# Altium project SmallHandheldRev1.PrjPCB
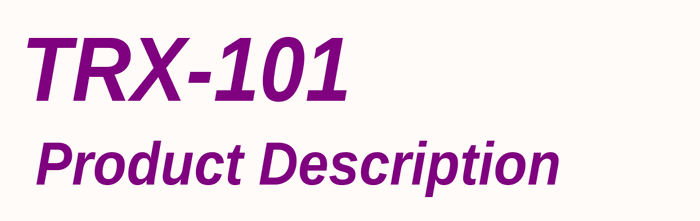
[diagram p0: PG01_Opening Page.SchDoc]
6 sheets, 248 parts. Net scope: global (net labels, ports and power ports of the same name join across sheets).
Board file: SmallHandheldRev1.PcbDoc
Sheets:
  PG01_Opening Page.SchDoc
  PG02_Index and Revs.SchDoc
  PG03_Schematic Sheet1.SchDoc
  PG04_Schematic Sheet2.SchDoc
  PG05_Schematic Sheet3.SchDoc
  PG06_Schematic Sheet4.SchDoc

## Sheet PG01_Opening Page.SchDoc: Opening Page
size B; Date: 12/29/2011; ApprovedBy: Touraj; DrawnBy: Touraj Ghaffari; Engineer: Touraj; Organization: ActiveWave; Address1: 902 Clint Moore Rd., Suite 126; Address2: Boca Raton; Address3: FL, 33487; Address4: 561-999-9422; DocumentNumber: 1; Revision: 1; SheetNumber: 1; SheetTotal: 6; PageSetup: Record=PageOptions|CenterHorizontal=True|CenterVertical=True|PrintScale=0.68|XCorrection=1.00|YCorrection=1.00|PrintKind=0|BorderSize=5000000|LeftOffset=0|BottomOffset=0|Orientation=2|PaperLength=1000|PaperWidth=1000|Scale=100|PaperSource=7|PrintQuality=-4|MediaType=1|DitherType=10|PaperKind=Letter (8.5 x 11 in.)|PrintScaleMode=1; Project: Small Handheld Reader

### Notes on the sheet
- TRX-101
- Product Description
- APPROVALS
- DATE
- Title:
- Drawn:
- Checked:
- Release:
- Date:
- Size:
- Sheet Name:
- B
- Number:
- Time:
- Revision:
- Sheet
- of
- File:

## Sheet PG02_Index and Revs.SchDoc: Index and Revisions
size B; Date: 12/29/2011; ApprovedBy: Touraj; DrawnBy: Touraj Ghaffari; Engineer: Touraj; Organization: ActiveWave; Address1: 902 Clint Moore Rd., Suite 126; Address2: Boca Raton; Address3: FL, 33487; Address4: 561-999-9422; DocumentNumber: 2; Revision: 1; SheetNumber: 2; SheetTotal: 6; PageSetup: Record=PageOptions|CenterHorizontal=True|CenterVertical=True|PrintScale=0.68|XCorrection=1.00|YCorrection=1.00|PrintKind=0|BorderSize=5000000|LeftOffset=0|BottomOffset=0|Orientation=2|PaperLength=1000|PaperWidth=1000|Scale=100|PaperSource=7|PrintQuality=-4|MediaType=1|DitherType=10|PaperKind=Letter|PrintScaleMode=1; Project: Small Hand Held Readere
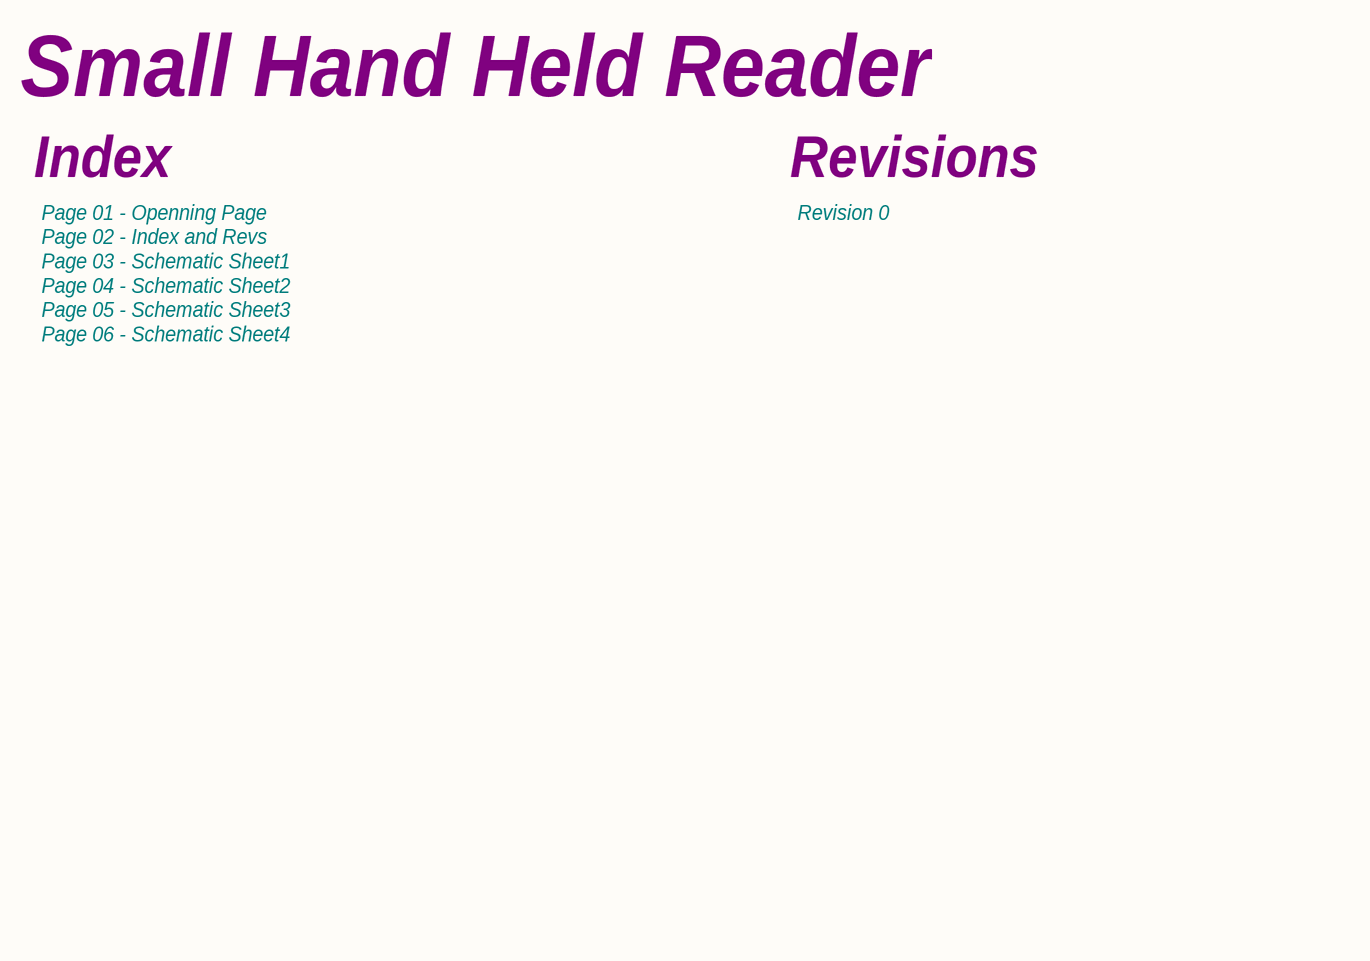
[diagram p1: PG02_Index and Revs.SchDoc]

### Notes on the sheet
- Small Hand Held Reader
- Index
- Revisions
- Page 01 - Openning Page
  Page 02 - Index and Revs
  Page 03 - Schematic Sheet1
  Page 04 - Schematic Sheet2
  Page 05 - Schematic Sheet3
  Page 06 - Schematic Sheet4
- Revision 0
- APPROVALS
- DATE
- Title:
- Drawn:
- Checked:
- Release:
- Date:
- Size:
- Sheet Name:
- B
- Number:
- Time:
- Revision:
- Sheet
- of
- File:

## Sheet PG03_Schematic Sheet1.SchDoc: Sheet 1  Receiver
size B; Date: 12/29/2011; ApprovedBy: Touraj; DrawnBy: Touraj Ghaffari; Engineer: Touraj; Organization: ActiveWave; Address1: 902 Clint Moore Rd., Suite 126; Address2: Boca Raton; Address3: FL, 33487; Address4: 561-999-9422; DocumentNumber: 3; Revision: 1; SheetNumber: 3; SheetTotal: 6; PageSetup: Record=PageOptions|CenterHorizontal=True|CenterVertical=True|PrintScale=0.70|XCorrection=1.00|YCorrection=1.00|PrintKind=0|BorderSize=5000000|LeftOffset=0|BottomOffset=0|Orientation=2|PaperLength=1000|PaperWidth=1000|Scale=100|PaperSource=7|PrintQuality=-4|MediaType=1|DitherType=10|PaperKind=Letter|PrintScaleMode=1; Project: Samll Hand Held Reader
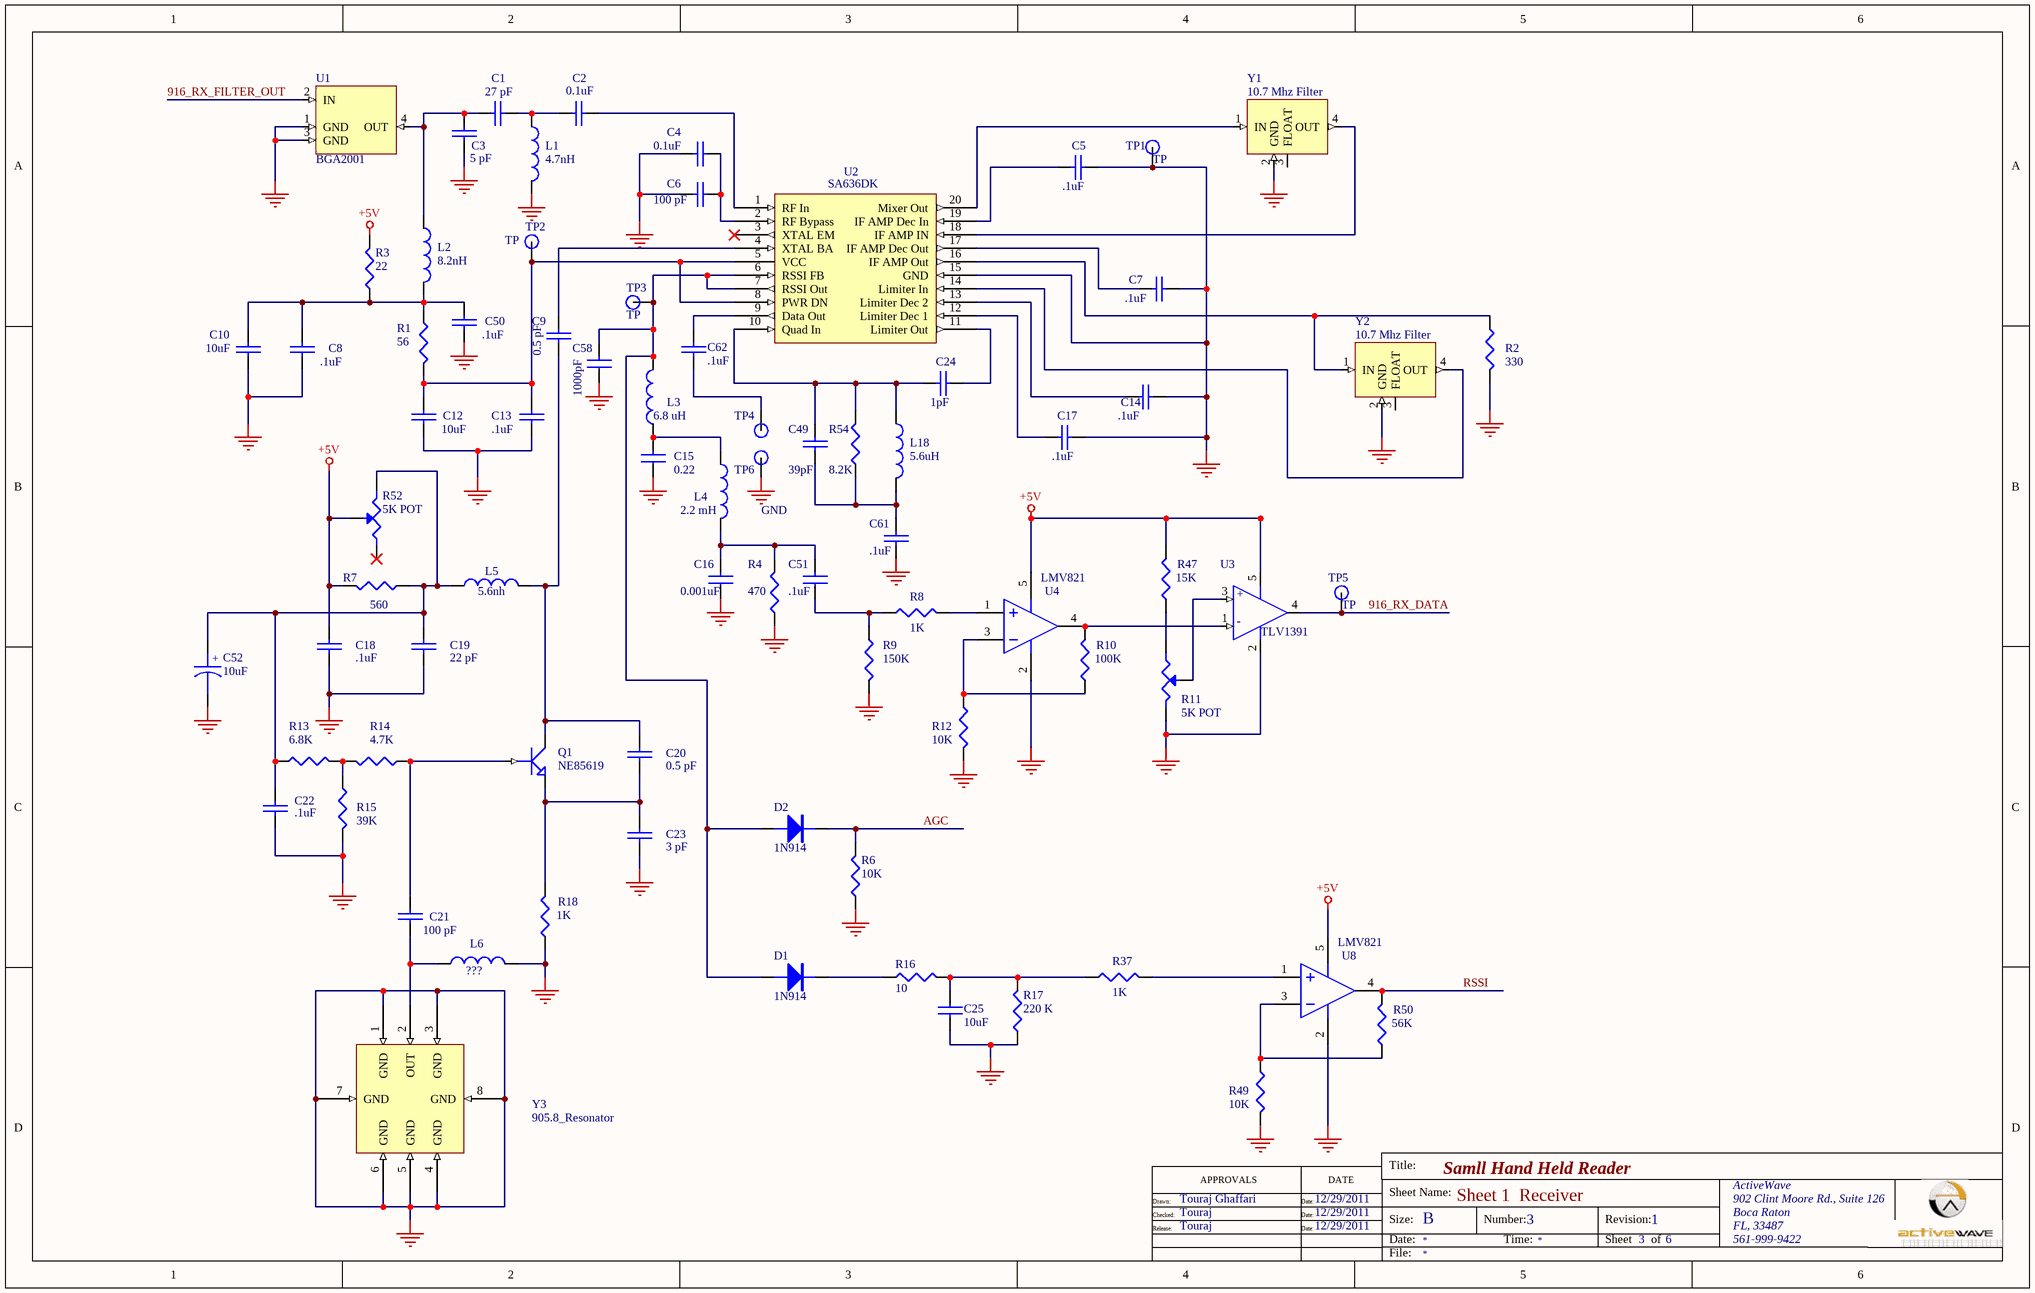
[diagram p2: PG03_Schematic Sheet1.SchDoc]

### Parts
C1  27 pF  [0603]
C2  0.1uF  [0603]
C3  5 pF  [0603]
C4  0.1uF  [0603]
C5  .1uF  [0603]
C6  100 pF  [0603]
C7  .1uF  [0603]
C8  .1uF  [0603]
C9  0.5 pF  [0603]
C10  10uF  [CAP A CASE]
C12  10uF  [CAP A CASE]
C13  .1uF  [0603]
C14  .1uF  [0603]
C15  0.22  [0603]
C16  0.001uF  [0603]
C17  .1uF  [0603]
C18  .1uF  [0603]
C19  22 pF  [0603]
C20  0.5 pF  [0603]
C21  100 pF  [0603]
C22  .1uF  [0603]
C23  3 pF  [0603]
C24  1pF  [0603]
C25  10uF  [CAP A CASE]
C49  39pF  [0603]
C50  .1uF  [0603]
C51  .1uF  [0603]
C52  10uF  [CAP A CASE]
C58  1000pF  [0603]
C61  .1uF  [0603]
C62  .1uF  [0603]
D1  1N914  [SOT23 DIODE]
D2  1N914  [SOT23 DIODE]
L1  4.7nH  [0603]
L2  8.2nH  [0603]
L3  6.8 uH  [0805]
L4  2.2 mH  [COIL TKS5540CT-ND]
L5  5.6nh  [0603]
L6  ???  [0603]
L18  5.6uH  [0603]
Q1  NE85619  [3 PIN ULTRA SUPER MINI MOLD]
R1  56  [0603]
R2  330  [0603]
R3  22  [0603]
R4  470  [0603]
R6  10K  [0603]
R7  560  [0603]
R8  1K  [0603]
R9  150K  [0603]
R10  100K  [0603]
R11  5K POT  [POT PANA EVN5]
R12  10K  [0603]
R13  6.8K  [0603]
R14  4.7K  [0603]
R15  39K  [0603]
R16  10  [0603]
R17  220 K  [0603]
R18  1K  [0603]
R37  1K  [0603]
R47  15K  [0603]
R49  10K  [0603]
R50  56K  [0603]
R52  5K POT  [POT PANA EVN5]
R54  8.2K  [0603]
TP1  TP  [TESTPOINT]
TP2  TP  [TESTPOINT]
TP3  TP  [TESTPOINT]
TP4  TP  [TESTPOINT]  (value not drawn)
TP5  TP  [TESTPOINT]
TP6  GND  [TESTPOINT]
U1  BGA2001  [SOT343]
U2  SA636DK  [SSOP20]
U3  TLV1391  [SOT25]
U4  LMV821  [SOT25]
U8  LMV821  [SOT25]
Y1  10.7 Mhz Filter  [FILTER2]
Y2  10.7 Mhz Filter  [FILTER2]
Y3  905.8_Resonator  [RESONATOR]

### Nets
+5V: C18.1 R3.2 R7.2 R47.2 R52.2 U3.5(VDD) U4.5 U8.5
GND_SIGNAL: C3.2 C4.1 C5.2 C6.1 C7.2 C8.2 C10.2 C12.2 C13.2 C14.2 C15.1 C16.1 C17.2 C18.2 C19.2 C22.2 C23.2 C25.2 C50.2 C52.2 C58.1 C61.2 L1.2 L6.2 R2.2 R4.1 R6.2 R9.2 R11.3 R12.2 R15.2 R17.2 R18.1 R49.2 TP1.1(TP) TP6.1(TP) U1.1(GND) U1.3(GND) U2.15(GND) U3.2(VSS) U4.2 U8.2 Y1.2(GND) Y2.2(GND) Y3.1(GND) Y3.3(GND) Y3.4(GND) Y3.5(GND) Y3.6(GND) Y3.7(GND) Y3.8(GND)
916_RX_DATA: TP5.1(TP) U3.4(OUT)
916_RX_FILTER_OUT: U1.2(IN)
AGC: D2.K R6.1
RSSI: R50.2 U8.4
NetC1_1: C1.1 C3.1 L2.1 U1.4(OUT)
NetC1_2: C1.2 C2.1 L1.1
NetC2_2: C2.2 U2.1(RF_In)
NetC4_2: C4.2 C6.2 U2.2(RF_Bypass)
NetC5_1: C5.1 U2.19(IF_AMP_Dec_In)
NetC7_1: C7.1 U2.17(IF_AMP_Dec_Out)
NetC8_1: C8.1 C10.1 C50.1 L2.2 R1.1 R3.1
NetC9_1: C9.1 C20.1 L5.2 Q1.C
NetC9_2: C9.2 U2.4(XTAL_BA)
NetC12_1: C12.1 C13.1 R1.2 TP2.1(TP) U2.5(VCC) U2.8(PWR_DN)
NetC14_1: C14.1 U2.13(Limiter_Dec_2)
NetC15_2: C15.2 L3.1 L4.1
NetC16_2: C16.2 C51.2 L4.2 R4.2
NetC17_1: C17.1 U2.12(Limiter_Dec_1)
NetC19_1: C19.1 C22.1 C52.1 L5.1 R7.1 R13.1 R52.1
NetC20_2: C20.2 C23.1 Q1.E R18.2
NetC21_1: C21.1 Q1.B R14.1
NetC21_2: C21.2 L6.1 Y3.2(OUT)
NetC24_1: C24.1 C49.1 L18.1 R54.2 U2.10(Quad_In)
NetC24_2: C24.2 U2.11(Limiter_Out)
NetC25_1: C25.1 R16.1 R17.1 R37.1
NetC49_2: C49.2 C61.1 L18.2 R54.1
NetC51_1: C51.1 R8.1 R9.1
NetC58_2: C58.2 D1.A D2.A L3.2 TP3.1(TP) U2.6(RSSI_FB) U2.7(RSSI_Out)
NetC62_1: C62.1 TP4.1(TP)
NetC62_2: C62.2 U2.9(Data_Out)
NetD1_K: D1.K R16.2
NetR2_1: R2.1 U2.16(IF_AMP_Out) Y2.1(IN)
NetR8_2: R8.2 U4.1
NetR10_1: R10.1 R12.1 U4.3
NetR10_2: R10.2 U3.1(-) U4.4
NetR11_1: R11.1 R47.1
NetR11_2: R11.2 U3.3(+)
NetR13_2: R13.2 R14.2 R15.1
NetR37_2: R37.2 U8.1
NetR49_1: R49.1 R50.1 U8.3
NetU2_14: U2.14(Limiter_In) Y2.4(OUT)
NetU2_18: U2.18(IF_AMP_IN) Y1.4(OUT)
NetU2_20: U2.20(Mixer_Out) Y1.1(IN)

Not connected (* = marked no-connect by the designer): R52 3*; U2 3(XTAL_EM)*; Y1 3(FLOAT); Y2 3(FLOAT)

### Notes on the sheet
- APPROVALS
- DATE
- Title:
- Drawn:
- Checked:
- Release:
- Date:
- Size:
- Sheet Name:
- B
- Number:
- Time:
- Revision:
- Sheet
- of
- File:
- (in symbol CAPACITOR POL) +

### Library data of the parts
C1-C10 C12-C14 C17-C24 C49 C50 C61 C62 = CAP: Capacitor
C15 C16 C25 C51 C58 = CAP_NP: Text Field1: 20; Text Field2: 10
C52 = CAPACITOR POL: Capacitor
D1 D2 = DIODE
L1-L6 L18 = INDUCTOR: Text Field1: 20; Text Field2: 40
Q1 = NPN1: NPN Transistor
R1-R4 R6 R8-R10 R12 R16 R17 R37 R47 R49 R50 R54 = R: Text Field1: 20; Text Field2: 30
R7 R13-R15 R18 = RESISTOR: Text Field1: 20; Text Field2: 30
R11 R52 = POT1: Potentiometer
TP6 = TP
U2 = SA636DK: Text Field1: 120; Text Field2: 110
U3 = TLV1391: Text Field1: 40; Text Field2: 40
U4 U8 = OPAMP1
Y1 Y2 = FILTER2
Y3 = RESONATOR2

## Sheet PG04_Schematic Sheet2.SchDoc: Sheet 2  433 MHz Transmitter
size B; Date: 12/29/2011; ApprovedBy: Touraj; DrawnBy: Touraj Ghaffari; Engineer: Touraj; Organization: ActiveWave; Address1: 902 Clint Moore Rd., Suite 126; Address2: Boca Raton; Address3: FL, 33487; Address4: 561-999-9422; DocumentNumber: 4; Revision: 1; SheetNumber: 4; SheetTotal: 6; PageSetup: Record=PageOptions|CenterHorizontal=True|CenterVertical=True|PrintScale=0.70|XCorrection=1.00|YCorrection=1.00|PrintKind=0|BorderSize=5000000|LeftOffset=0|BottomOffset=0|Orientation=2|PaperLength=1000|PaperWidth=1000|Scale=100|PaperSource=7|PrintQuality=-4|MediaType=1|DitherType=10|PaperKind=Letter|PrintScaleMode=1; Project: Samll Hand Held Reader
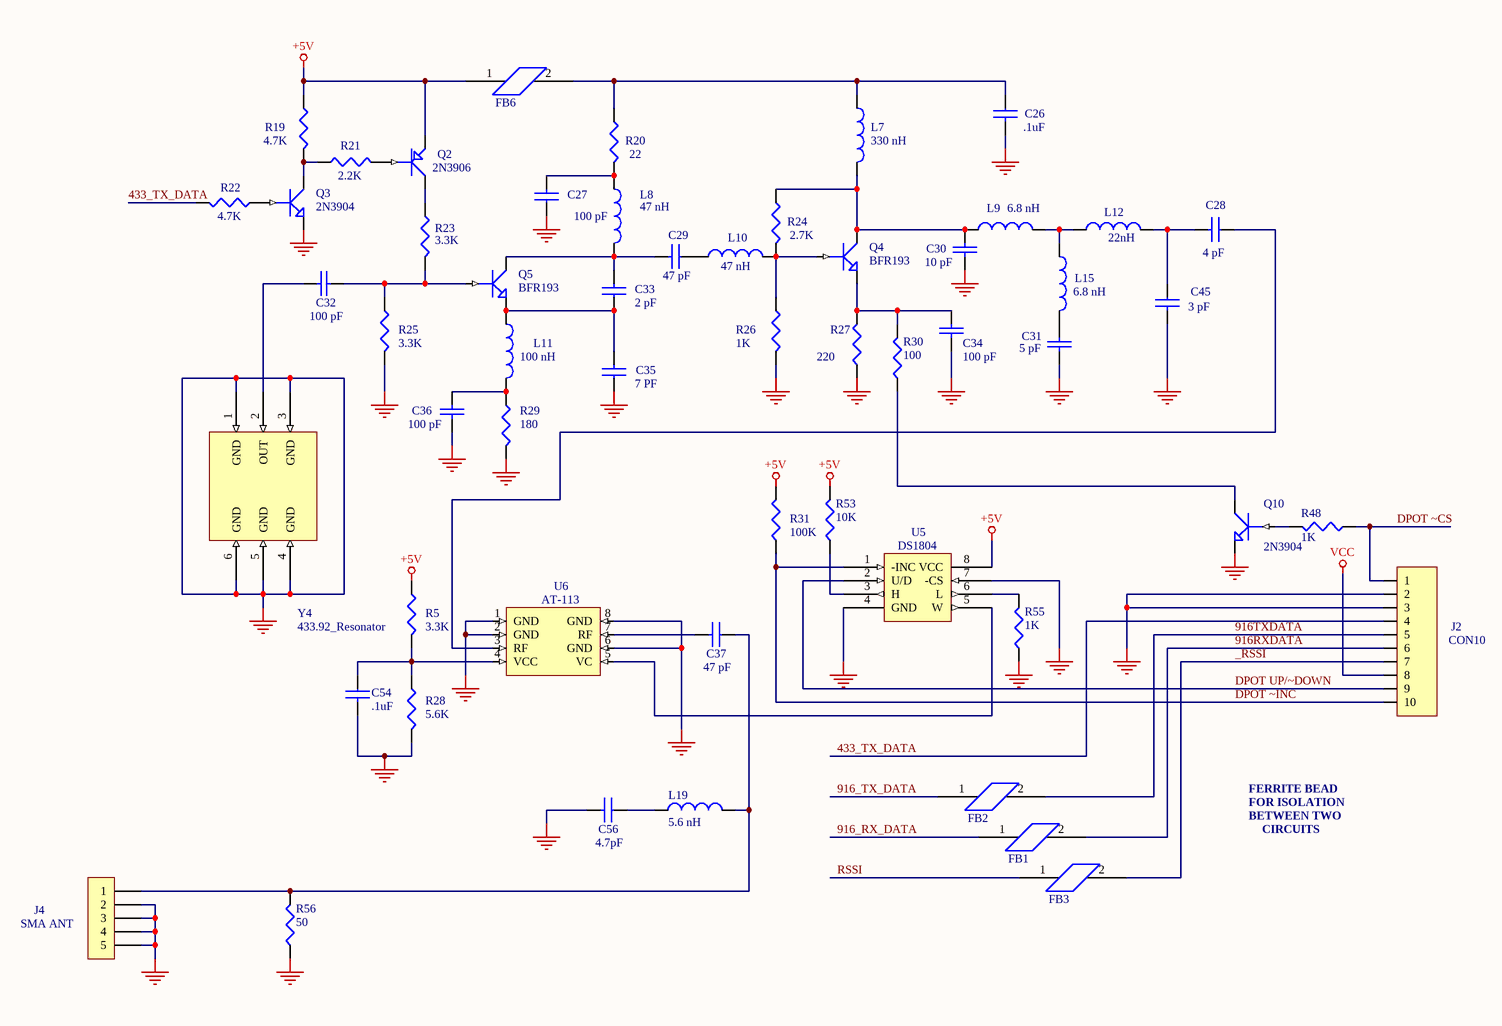
[diagram p3: PG04_Schematic Sheet2.SchDoc]

### Parts
C26  .1uF  [0603]
C27  100 pF  [0603]
C28  4 pF  [0603]
C29  47 pF  [0603]
C30  10 pF  [0603]
C31  5 pF  [0603]
C32  100 pF  [0603]
C33  2 pF  [0603]
C34  100 pF  [0603]
C35  7 PF  [0603]
C36  100 pF  [0603]
C37  47 pF  [0603]
C45  3 pF  [0603]
C54  .1uF  [0603]
C56  4.7pF  [0603]
FB1  FB  [0603]  (value not drawn)
FB2  FB  [0603]  (value not drawn)
FB3  FB  [0603]  (value not drawn)
FB6  FB  [0603]  (value not drawn)
J2  CON10  [1X10 HEADER]
J4  SMA ANT  [50 OHM ANT]
L7  330 nH  [0805]
L8  47 nH  [0603]
L9  6.8 nH  [0603]
L10  47 nH  [0603]
L11  100 nH  [0603]
L12  22nH  [0603]
L15  6.8 nH  [0603]
L19  5.6 nH  [0603]
Q2  2N3906  [SOT23 TRANS]
Q3  2N3904  [SOT23 TRANS]
Q4  BFR193  [SOT23 TRANS]
Q5  BFR193  [SOT23 TRANS]
Q10  2N3904  [SOT23 TRANS]
R5  3.3K  [0603]
R19  4.7K  [0603]
R20  22  [0603]
R21  2.2K  [0603]
R22  4.7K  [0603]
R23  3.3K  [0603]
R24  2.7K  [0603]
R25  3.3K  [0603]
R26  1K  [0603]
R27  220  [0603]
R28  5.6K  [0603]
R29  180  [0603]
R30  100  [0603]
R31  100K  [0603]
R48  1K  [0603]
R53  10K  [0603]
R55  1K  [0603]
R56  50  [0603]
U5  DS1804  [SO8 SMALL]
U6  AT-113  [SO8]
Y4  433.92_Resonator  [RESONATOR2]

### Nets
+5V: FB6.1 Q2.E R5.1 R19.1 R31.1 R53.2 U5.8(VCC)
GND_SIGNAL: C26.2 C27.1 C30.2 C31.2 C34.2 C35.1 C36.2 C45.2 C54.2 C56.2 J2.2 J2.3 J4.2 J4.3 J4.4 J4.5 Q3.E Q10.E R25.2 R26.2 R27.2 R28.2 R29.2 R55.1 R56.1 U5.4(GND) U5.7(-CS) U6.1(GND) U6.2(GND) U6.6(GND) U6.8(GND) Y4.1(GND) Y4.3(GND) Y4.4(GND) Y4.5(GND) Y4.6(GND)
VCC: J2.8
433_TX_DATA: J2.4 R22.2
916_RX_DATA: FB1.1
916_TX_DATA: FB2.1
916RXDATA: FB1.2 J2.6
916TXDATA: FB2.2 J2.5
_RSSI: FB3.2 J2.7
DPOT UP/~DOWN: J2.9 U5.2(U/D)
DPOT ~CS: J2.1 R48.2
DPOT ~INC: J2.10 R31.2 U5.1(-INC)
RSSI: FB3.1
NetC26_1: C26.1 FB6.2 L7.1 R20.1
NetC27_2: C27.2 L8.1 R20.2
NetC28_1: C28.1 U6.3(RF)
NetC28_2: C28.2 C45.1 L12.2
NetC29_1: C29.1 L10.1
NetC29_2: C29.2 C33.2 L8.2 Q5.C
NetC30_1: C30.1 L7.2 L9.1 Q4.C R24.1
NetC31_1: C31.1 L15.2
NetC32_1: C32.1 Y4.2(OUT)
NetC32_2: C32.2 Q5.B R23.2 R25.1
NetC33_1: C33.1 C35.2 L11.1 Q5.E
NetC34_1: C34.1 Q4.E R27.1 R30.2
NetC36_1: C36.1 L11.2 R29.1
NetC37_1: C37.1 J4.1 L19.2 R56.2
NetC37_2: C37.2 U6.7(RF)
NetC54_1: C54.1 R5.2 R28.1 U6.4(VCC)
NetC56_1: C56.1 L19.1
NetL9_2: L9.2 L12.1 L15.1
NetL10_2: L10.2 Q4.B R24.2 R26.1
NetQ2_B: Q2.B R21.2
NetQ2_C: Q2.C R23.1
NetQ3_B: Q3.B R22.1
NetQ3_C: Q3.C R19.2 R21.1
NetQ10_B: Q10.B R48.1
NetQ10_C: Q10.C R30.1
NetR53_1: R53.1 U5.3(H)
NetR55_2: R55.2 U5.6(L)
NetU5_5: U5.5(W) U6.5(VC)

### Notes on the sheet
- FERRITE BEAD
- FOR ISOLATION
- BETWEEN TWO
- CIRCUITS
- APPROVALS
- DATE
- Title:
- Drawn:
- Checked:
- Release:
- Date:
- Size:
- Sheet Name:
- B
- Number:
- Time:
- Revision:
- Sheet
- of
- File:

### Library data of the parts
C26-C29 C33 C35 C37 C45 C54 C56 = CAP_NP: Text Field1: 20; Text Field2: 10
C30-C32 C34 C36 = CAP: Capacitor
FB1-FB3 FB6 = FB_0603: Part Field 1: Part Number EXC-ML16A270U; Part Field 2: Vendor Panasonic - ECG; Part Field 3: Description BEAD CORE 27 OHM 4A 0603 SMD
J2 = CON10: Text Field1: 30; Text Field2: 110
J4 = CON5: Connector
L7-L12 L15 L19 = INDUCTOR: Text Field1: 20; Text Field2: 40
Q2 = PNP1: PNP Transistor
Q3-Q5 Q10 = NPN1: NPN Transistor
R5 R19-R31 R48 R53 R55 R56 = RESISTOR: Text Field1: 20; Text Field2: 30
U5 = DS1804: Text Field1: 50; Text Field2: 50
U6 = AT-113A
Y4 = RESONATOR2

## Sheet PG05_Schematic Sheet3.SchDoc: Sheet 3  916 MhzTransmitter
size B; Date: 12/29/2011; ApprovedBy: Touraj; DrawnBy: Touraj Ghaffari; Engineer: Touraj; Organization: ActiveWave; Address1: 902 Clint Moore Rd., Suite 126; Address2: Boca Raton; Address3: FL, 33487; Address4: 561-999-9422; DocumentNumber: 5; Revision: 1; SheetNumber: 5; SheetTotal: 6; PageSetup: Record=PageOptions|CenterHorizontal=True|CenterVertical=True|PrintScale=0.70|XCorrection=1.00|YCorrection=1.00|PrintKind=0|BorderSize=5000000|LeftOffset=0|BottomOffset=0|Orientation=2|PaperLength=1000|PaperWidth=1000|Scale=100|PaperSource=7|PrintQuality=-4|MediaType=1|DitherType=10|PaperKind=Letter|PrintScaleMode=1; Project: Samll Hand Held Reader
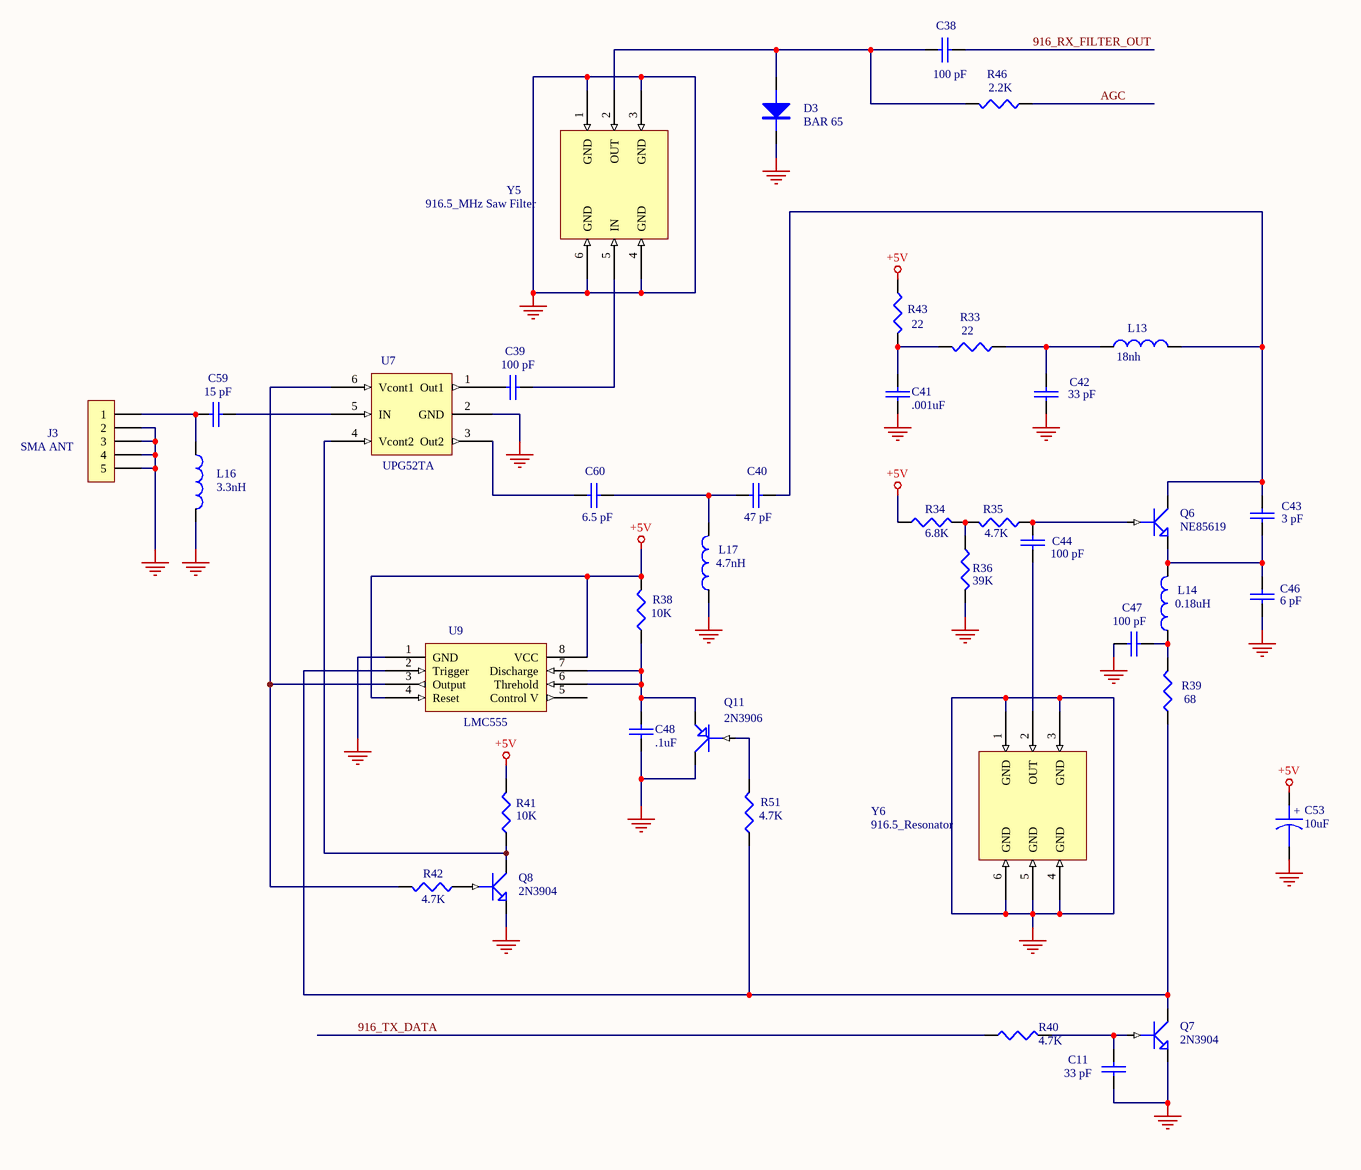
[diagram p4: PG05_Schematic Sheet3.SchDoc]

### Parts
C11  33 pF  [0603]
C38  100 pF  [0603]
C39  100 pF  [0603]
C40  47 pF  [0603]
C41  .001uF  [0603]
C42  33 pF  [0603]
C43  3 pF  [0603]
C44  100 pF  [0603]
C46  6 pF  [0603]
C47  100 pF  [0603]
C48  .1uF  [0603]
C53  10uF  [CAP A CASE]
C59  15 pF  [0603]
C60  6.5 pF  [0603]
D3  BAR 65  [DIODE SC79]
J3  SMA ANT  [50 OHM ANT]
L13  18nh  [0603]
L14  0.18uH  [0603]
L16  3.3nH  [0603]
L17  4.7nH  [0603]
Q6  NE85619  [3 PIN ULTRA SUPER MINI MOLD]
Q7  2N3904  [SOT23 TRANS]
Q8  2N3904  [SOT23 TRANS]
Q11  2N3906  [SOT23 TRANS]
R33  22  [0603]
R34  6.8K  [0603]
R35  4.7K  [0603]
R36  39K  [0603]
R38  10K  [0603]
R39  68  [0603]
R40  4.7K  [0603]
R41  10K  [0603]
R42  4.7K  [0603]
R43  22  [0603]
R46  2.2K  [0603]
R51  4.7K  [0603]
U7  UPG52TA  [TO6]
U9  LMC555  [SO8 SMALL]
Y5  916.5_MHz Saw Filter  [RESONATOR2]
Y6  916.5_Resonator  [RESONATOR2]

### Nets
+5V: C53.1 R34.1 R38.2 R41.2 R43.1 U9.4(Reset) U9.8(VCC)
GND_SIGNAL: C11.2 C41.2 C42.2 C46.2 C47.1 C48.2 C53.2 D3.K J3.2 J3.3 J3.4 J3.5 L16.2 L17.1 Q7.E Q8.E Q11.C R36.2 U7.2(GND) U9.1(GND) Y5.1(GND) Y5.3(GND) Y5.4(GND) Y5.6(GND) Y6.1(GND) Y6.3(GND) Y6.4(GND) Y6.5(GND) Y6.6(GND)
916_RX_FILTER_OUT: C38.2
916_TX_DATA: R40.1
AGC: R46.1
NetC11_1: C11.1 Q7.B R40.2
NetC38_1: C38.1 D3.A R46.2 Y5.2(OUT)
NetC39_1: C39.1 U7.1(Out1)
NetC39_2: C39.2 Y5.5(IN)
NetC40_1: C40.1 C60.2 L17.2
NetC40_2: C40.2 C43.1 L13.2 Q6.C
NetC41_1: C41.1 R33.2 R43.2
NetC42_1: C42.1 L13.1 R33.1
NetC43_2: C43.2 C46.1 L14.2 Q6.E
NetC44_1: C44.1 Q6.B R35.1
NetC44_2: C44.2 Y6.2(OUT)
NetC47_2: C47.2 L14.1 R39.2
NetC48_1: C48.1 Q11.E R38.1 U9.6(Threhold) U9.7(Discharge)
NetC59_1: C59.1 J3.1 L16.1
NetC59_2: C59.2 U7.5(IN)
NetC60_1: C60.1 U7.3(Out2)
NetQ7_C: Q7.C R39.1 R51.1 U9.2(Trigger)
NetQ8_B: Q8.B R42.1
NetQ8_C: Q8.C R41.1 U7.4(Vcont2)
NetQ11_B: Q11.B R51.2
NetR34_2: R34.2 R35.2 R36.1
NetR42_2: R42.2 U7.6(Vcont1) U9.3(Output)

Not connected (* = marked no-connect by the designer): U9 5(Control_V)

### Notes on the sheet
- APPROVALS
- DATE
- Title:
- Drawn:
- Checked:
- Release:
- Date:
- Size:
- Sheet Name:
- B
- Number:
- Time:
- Revision:
- Sheet
- of
- File:
- (in symbol CAPACITOR POL) +

### Library data of the parts
C11 C38-C44 C46-C48 C59 C60 = CAP: Capacitor
C53 = CAPACITOR POL: Capacitor
D3 = DIODE
J3 = CON5: Connector
L13 = INDUCTOR: INDUCTOR 18NH 5% 0603 SMD; VendorPartNumber: PCD1976TR-ND; MFG_PartNumber: ELJ-RE18NJFA; Text Field1: 20; Text Field2: 40; Vendor: DigiKey; MFG: Panasdonic; Value: 18nh
L14 L16 L17 = INDUCTOR: Text Field1: 20; Text Field2: 40
Q6-Q8 = NPN1: NPN Transistor
Q11 = PNP1: PNP Transistor
R33-R36 R38-R43 R46 R51 = RESISTOR: Text Field1: 20; Text Field2: 30
U7 = UPG152TA_0: Text Field1: 60; Text Field2: 60
U9 = LMC555: Text Field1: 90; Text Field2: 50
Y5 = RESONATOR3
Y6 = RESONATOR2

## Sheet PG06_Schematic Sheet4.SchDoc: Sheet 4  Reader
size 431 x 279 mm; Organization: ActiveWave; Address1: 902 Clint Moore Rd., Suite 126; Address2: Boca Raton; Address3: FL, 33487; Address4: 561-999-9422; DocumentNumber: 6; Revision: 1; SheetNumber: 6; SheetTotal: 6; Date: 12/29/2011; ApprovedBy: Touraj; DrawnBy: Juan A. Nadal; Engineer: Touraj; PageSetup: Record=PageOptions|CenterHorizontal=True|CenterVertical=True|PrintScale=0.61|XCorrection=1.00|YCorrection=1.00|PrintKind=1|BorderSize=5000000|LeftOffset=0|BottomOffset=0|Orientation=2|PaperLength=1000|PaperWidth=1000|Scale=100|PaperSource=7|PrintQuality=600|MediaType=1|DitherType=10|PaperKind=Letter|PrintScaleMode=1; Project: Samll Hand Held Reader
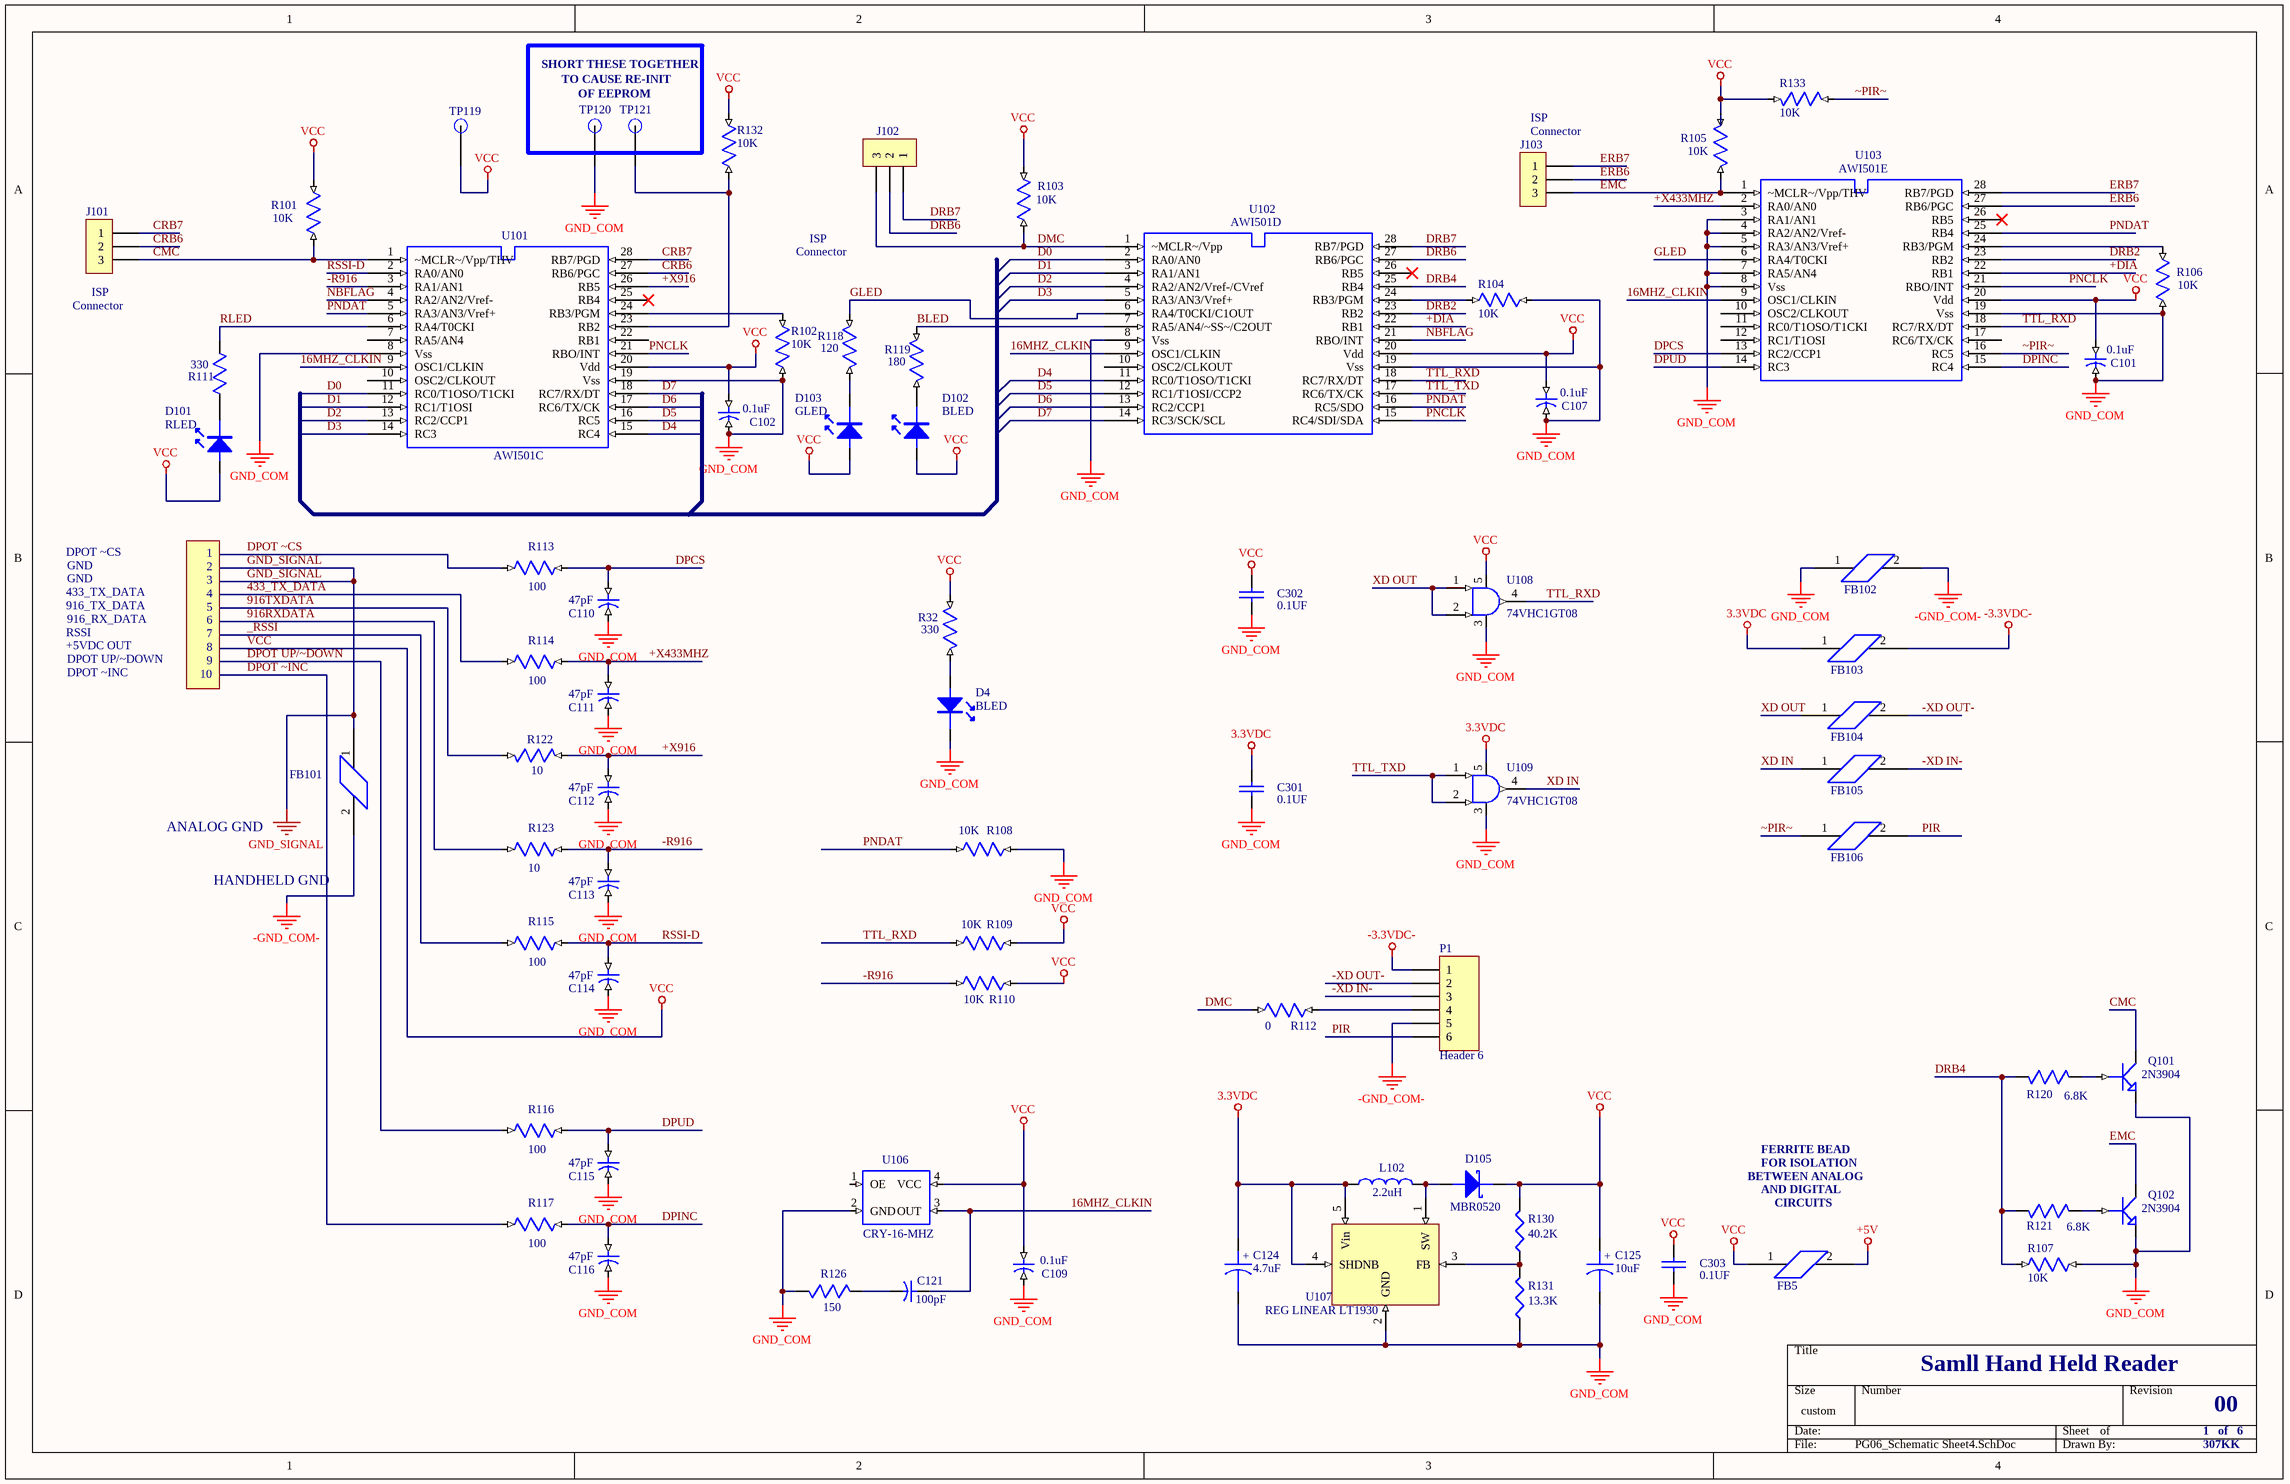
[diagram p5: PG06_Schematic Sheet4.SchDoc]

### Parts
C101  0.1uF  [0603]
C102  0.1uF  [0603]
C107  0.1uF  [0603]
C109  0.1uF  [0603]
C110  47pF  [0603]
C111  47pF  [0603]
C112  47pF  [0603]
C113  47pF  [0603]
C114  47pF  [0603]
C115  47pF  [0603]
C116  47pF  [0603]
C121  100pF  [0603]
C124  4.7uF  [CAP A CASE]
C125  10uF  [CAP A CASE]
C301  0.1UF  [0603]
C302  0.1UF  [0603]
C303  0.1UF  [0603]
D4  BLED  [404-1032-2-ND]
D101  RLED  [404-1032-2-ND]
D102  BLED  [404-1032-2-ND]
D103  GLED  [404-1032-2-ND]
D105  MBR0520  [SOD123_021405]
FB5  FB  [0603]  (value not drawn)
FB101  FB  [0603]  (value not drawn)
FB102  FB  [0603]  (value not drawn)
FB103  FB  [0603]  (value not drawn)
FB104  FB  [0603]  (value not drawn)
FB105  FB  [0603]  (value not drawn)
FB106  FB  [0603]  (value not drawn)
J101  1X3 HEADER  [1X3 HEADER TEST PADS]  (value not drawn)
J102  1X3 HEADER  [1X3 HEADER TEST PADS]  (value not drawn)
J103  1X3 HEADER  [1X3 HEADER TEST PADS]  (value not drawn)
L102  2.2uH  [COIL BOURNS SDR7030-330M]
P1  Header 6  [1X6 HEADER]
Q101  2N3904  [SOT23 TRANS]
Q102  2N3904  [SOT23 TRANS]
R32  330  [0603]
R101  10K  [0603]
R102  10K  [0603]
R103  10K  [0603]
R104  10K  [0603]
R105  10K  [0603]
R106  10K  [0603]
R107  10K  [0603]
R108  10K  [0603]
R109  10K  [0603]
R110  10K  [0603]
R111  330  [0603]
R112  0  [0603]
R113  100  [0603]
R114  100  [0603]
R115  100  [0603]
R116  100  [0603]
R117  100  [0603]
R118  120  [0603]
R119  180  [0603]
R120  6.8K  [0603]
R121  6.8K  [0603]
R122  10  [0603]
R123  10  [0603]
R126  150  [0603]
R130  40.2K  [0603]
R131  13.3K  [0603]
R132  10K  [0603]
R133  10K  [0603]
TP119  TP  [TESTPOINT_SMT]  (value not drawn)
TP120  TP  [TESTPOINT_SMT]  (value not drawn)
TP121  TP  [TESTPOINT]  (value not drawn)
U101  AWI501C  [SSOP28]
U102  AWI501D  [SSOP28]
U103  AWI501E  [SSOP28]
U106  CRY-16-MHZ  [SMT OSCILLATOR]
U107  REG LINEAR LT1930  [SOT23-5A]
U108  value 74VHC1GT08  [SC70]  (hidden comment: Single And Gate)
U109  74VHC1GT08  [SC70]

### Nets
3.3VDC: C124.1 C301.1 FB103.1 L102.1 U107.4(SHDNB) U107.5(Vin) U109.5(VCC)
+5V: FB5.2
-3.3VDC-: FB103.2 P1.1
-GND_COM-: FB101.2 FB102.2 P1.5
GND_COM: C101.2(B) C102.2(B) C107.2(B) C109.2(B) C110.2(B) C111.2(B) C112.2(B) C113.2(B) C114.2(B) C115.2(B) C116.2(B) C124.2 C125.2 C301.2 C302.2 C303.2 D4.K FB102.1 Q101.E Q102.E R102.2(B) R104.1(A) R106.2(B) R107.2(B) R108.1(A) R126.2(B) R131.1 TP120.1(TP) U101.8(Vss) U101.19(Vss) U102.8(Vss) U102.19(Vss) U103.3(RA1/AN1) U103.4(RA2/AN2/Vref-) U103.5(RA3/AN3/Vref+) U103.7(RA5/AN4) U103.8(Vss) U103.19(Vss) U106.2(GND) U107.2(GND) U108.3(GND) U109.3(GND)
GND_SIGNAL: FB101.1
VCC: C101.1(A) C102.1(A) C107.1(A) C109.1(A) C125.1 C302.1 C303.1 D101.A D102.A D103.A D105.K FB5.1 R32.2(B) R101.1(A) R103.1(A) R105.1(A) R109.1(A) R110.1(A) R130.2 R132.1(A) R133.1(A) TP119.1(TP) U101.20(Vdd) U102.20(Vdd) U103.20(Vdd) U106.4(VCC) U108.5(VCC)
16MHZ_CLKIN: C121.1(A) U101.9(OSC1/CLKIN) U102.9(OSC1/CLKIN) U103.9(OSC1/CLKIN) U106.3(OUT)
433_TX_DATA: R114.1(A)
916RXDATA: R123.1(A)
916TXDATA: R122.2(B)
+DIA: U102.22(RB1) U103.22(RB1)
+X433MHZ: C111.1(A) R114.2(B) U103.2(RA0/AN0)
+X916: C112.1(A) R122.1(A) U101.26(RB5)
-R916: C113.1(A) R110.2(B) R123.2(B) U101.3(RA1/AN1)
-XD IN-: FB105.2 P1.3
-XD OUT-: FB104.2 P1.2
_RSSI: R115.1(A)
BLED: R119.2(B) U102.7(RA5/AN4/~SS~/C2OUT)
CMC: J101.3 Q101.C R101.2(B) U101.1(~MCLR~/Vpp/THV)
CRB6: J101.2 U101.27(RB6/PGC)
CRB7: J101.1 U101.28(RB7/PGD)
D0: U101.11(RC0/T1OSO/T1CKI) U102.2(RA0/AN0)
D1: U101.12(RC1/T1OSI) U102.3(RA1/AN1)
D2: U101.13(RC2/CCP1) U102.4(RA2/AN2/Vref-/CVref)
D3: U101.14(RC3) U102.5(RA3/AN3/Vref+)
D4: U101.15(RC4) U102.11(RC0/T1OSO/T1CKI)
D5: U101.16(RC5) U102.12(RC1/T1OSI/CCP2)
D6: U101.17(RC6/TX/CK) U102.13(RC2/CCP1)
D7: U101.18(RC7/RX/DT) U102.14(RC3/SCK/SCL)
DMC: J102.3 R103.2(B) R112.2(B) U102.1(~MCLR~/Vpp)
DPCS: C110.1(A) R113.2(B) U103.13(RC2/CCP1)
DPINC: C116.1(A) R117.2(B) U103.15(RC4)
DPOT UP/~DOWN: R116.1(A)
DPOT ~CS: R113.1(A)
DPOT ~INC: R117.1(A)
DPUD: C115.1(A) R116.2(B) U103.14(RC3)
DRB2: U102.23(RB2) U103.23(RB2)
DRB4: R107.1(A) R120.1(A) R121.1(A) U102.25(RB4)
DRB6: J102.2 U102.27(RB6/PGC)
DRB7: J102.1 U102.28(RB7/PGD)
EMC: J103.3 Q102.C R105.2(B) U103.1(~MCLR~/Vpp/THV)
ERB6: J103.2 U103.27(RB6/PGC)
ERB7: J103.1 U103.28(RB7/PGD)
GLED: R118.2(B) U102.6(RA4/T0CKI/C1OUT) U103.6(RA4/T0CKI)
NBFLAG: U101.4(RA2/AN2/Vref-) U102.21(RBO/INT)
PIR: FB106.2 P1.6
PNCLK: U101.21(RBO/INT) U102.15(RC4/SDI/SDA) U103.21(RBO/INT)
PNDAT: R108.2(B) U101.5(RA3/AN3/Vref+) U102.16(RC5/SDO) U103.25(RB4)
RLED: R111.2(B) U101.6(RA4/T0CKI)
RSSI-D: C114.1(A) R115.2(B) U101.2(RA0/AN0)
TTL_RXD: R109.2(B) U102.18(RC7/RX/DT) U103.18(RC7/RX/DT) U108.4(OUTY)
TTL_TXD: U102.17(RC6/TX/CK) U109.1(INB) U109.2(INA)
XD IN: FB105.1 U109.4(OUTY)
XD OUT: FB104.1 U108.1(INB) U108.2(INA)
~PIR~: FB106.1 R133.2(B) U103.16(RC5)
NetC121_2: C121.2(B) R126.1(A)
NetD4_A: D4.A R32.1(A)
NetD101_K: D101.K R111.1(A)
NetD102_K: D102.K R119.1(A)
NetD103_K: D103.K R118.1(A)
NetD105_A: D105.A L102.2 U107.1(SW)
NetP1_4: P1.4 R112.1(A)
NetQ101_B: Q101.B R120.2(B)
NetQ102_B: Q102.B R121.2(B)
NetR102_1: R102.1(A) U101.24(RB3/PGM)
NetR104_2: R104.2(B) U102.24(RB3/PGM)
NetR106_1: R106.1(A) U103.24(RB3/PGM)
NetR130_1: R130.1 R131.2 U107.3(FB)
NetR132_2: R132.2(B) TP121.1(TP) U101.23(RB2)

Not connected (* = marked no-connect by the designer): U101 7(RA5/AN4) 10(OSC2/CLKOUT) 22(RB1) 25(RB4)*; U102 10(OSC2/CLKOUT) 26(RB5)*; U103 10(OSC2/CLKOUT) 11(RC0/T1OSO/T1CKI) 12(RC1/T1OSI) 17(RC6/TX/CK) 26(RB5)*; U106 1(OE)

### Notes on the sheet
- SHORT THESE TOGETHER
- TO CAUSE RE-INIT
- OF EEPROM
- (near J103) ISP
- (near J103) Connector
- (near J101) ISP
- Connector
- ISP
- (near J101) Connector
- DPOT ~CS
- GND
- 1
- 2
- 916_TX_DATA
- 433_TX_DATA
- RSSI
- 916_RX_DATA
- 3
- 4
- 5
- 6
- +5VDC OUT
- DPOT ~INC
- DPOT UP/~DOWN
- 10
- 7
- 8
- 9
- ANALOG GND
- HANDHELD GND
- FERRITE BEAD
- FOR ISOLATION
- BETWEEN ANALOG
- AND DIGITAL
- CIRCUITS
- Samll Hand Held Reader
- 1   of   6
- 00
- 307KK
- (in symbol CAPACITOR POL) +

### Library data of the parts
C101 C102 C107 C109 = C_603: Part Field 1: Part Number ECJ-1VF1H104Z; Part Field 2: Vendor Panasonic - ECG; Part Field 3: Description CAP .1UF 50V CERAMIC Y5V 0603
C110-C116 = C0603: Part Field 1: Part Number 0603N470J500NT; Part Field 2: Vendor BC Components; Part Field 3: Description Cap, Ceramic, 47pF, 50V, NP0, 0603, SMD
C121 = C_0603: Part Field 1: Part Number ECJ-1VC1H101J; Part Field 2: Vendor Panasonic - ECG; Part Field 3: Description CAP CERAMIC 100PF 50V 0603 SMD
C124 C125 = CAPACITOR POL: Capacitor
C301-C303 = CAP: Capacitor
D4 D101-D103 = LED
D105 = DIODE SCHOTTKY: Schottky Diode
FB5 FB101-FB106 = FB_0603: Part Field 1: Part Number EXC-ML16A270U; Part Field 2: Vendor Panasonic - ECG; Part Field 3: Description BEAD CORE 27 OHM 4A 0603 SMD
J101-J103 = CON3: Connector
L102 = INDUCTOR1
P1 = Header 6: Header, 6-Pin; LatestRevisionDate: 17-Jul-2002; LatestRevisionNote: Re-released for DXP Platform.; Publisher: Altium Limited
Q101 Q102 = NPN1: NPN Transistor
R32 = R0402: Part Field 1: Part Number ERJ-3GEYJ331V; Part Field 2: Vendor Panasonic - ECG; Part Field 3: Description RES 330 OHM 1/10W 5% 0603 SMD
R101-R110 R112 R132 R133 = R_603: Part Field 1: Part Number ERA-V15J103V; Part Field 2: Vendor Panasonic - ECG; Part Field 3: Description RES 10K OHM 1/16W 1500PPM 5%0603
R111 = R_0603: Part Field 1: Part Number ERJ-3GEYJ331V; Part Field 2: Vendor Panasonic - ECG; Part Field 3: Description RES 330 OHM 1/10W 5% 0603 SMD
R113-R117 R123 = R0603: Part Field 1: Part Number 9C06031A1000JLHFT; Part Field 2: Vendor Yageo America; Part Field 3: Description RES, 100 OHM, 1/10W, 5%, 0603, SMD
R118 = R0402: Part Field 1: Part Number ERJ-3GEYJ121V; Part Field 2: Vendor Panasonic - ECG; Part Field 3: Description RES 120 OHM 1/10W 5% 0603 SMD
R119 = R0402: Part Field 1: Part Number ERJ-3GEYJ181V; Part Field 2: Vendor Panasonic - ECG; Part Field 3: Description RES 180 OHM 1/10W 5% 0603 SMD
R120 R121 = R_0603: Part Field 1: Part Number ERJ-3GEYJ682V; Part Field 2: Vendor Panasonic - ECG; Part Field 3: Description RES 6.8K OHM 1/10W 5% 0603 SMD
R122 = R_603: Part Field 1: Part Number 9C06031A10R0FKHFT; Part Field 2: Vendor Yageo America; Part Field 3: Description RES, 10, OHM, 1/16W, 5%, 0603, SMD
R126 = R_0603: Part Field 1: Part Number 9C06031A1500JLHFT; Part Field 2: Vendor Yageo America; Part Field 3: Description RES 150 OHM 1/16W 5% 0603 SMD
R130 R131 = RES1
TP119-TP121 = TESTPOINT_1
U101 U103 = PIC16F870: Part Field 1: Part Number PIC16F870-E/SO; Part Field 2: Vendor Microchip Technology; Part Field 3: Description IC MCU CMOS 20MHZ 2K FLSH 28SOIC
U102 = PIC16F876A: Part Field 1: Part Number PIC16F876A-E/SO; Part Field 2: Vendor Microchip Technology; Part Field 3: Description IC MCU FLASH 8KX14 W/AD 28-SOIC
U106 = CRY-SMD-5-7
U108 = 7408_SINGLE: PART NO: NEW
U109 = 7408_SINGLE: Single AND Gate; PART NO: NC7SZ08P5X; VALUE: 74VHC1GT08; DK: NC7SZ08P5XCT-ND

## Nets that join several sheets
+5V: PG03_Schematic Sheet1 (8 pins), PG04_Schematic Sheet2 (7 pins), PG05_Schematic Sheet3 (7 pins), PG06_Schematic Sheet4 (FB5.2)
GND_SIGNAL: PG03_Schematic Sheet1 (51 pins), PG04_Schematic Sheet2 (36 pins), PG05_Schematic Sheet3 (29 pins), PG06_Schematic Sheet4 (FB101.1)
VCC: PG04_Schematic Sheet2 (J2.8), PG06_Schematic Sheet4 (27 pins)
433_TX_DATA: PG04_Schematic Sheet2 (J2.4 R22.2), PG06_Schematic Sheet4 (R114.1)
916_RX_DATA: PG03_Schematic Sheet1 (TP5.1 U3.4), PG04_Schematic Sheet2 (FB1.1)
916_RX_FILTER_OUT: PG03_Schematic Sheet1 (U1.2), PG05_Schematic Sheet3 (C38.2)
916_TX_DATA: PG04_Schematic Sheet2 (FB2.1), PG05_Schematic Sheet3 (R40.1)
916RXDATA: PG04_Schematic Sheet2 (FB1.2 J2.6), PG06_Schematic Sheet4 (R123.1)
916TXDATA: PG04_Schematic Sheet2 (FB2.2 J2.5), PG06_Schematic Sheet4 (R122.2)
_RSSI: PG04_Schematic Sheet2 (FB3.2 J2.7), PG06_Schematic Sheet4 (R115.1)
AGC: PG03_Schematic Sheet1 (D2.K R6.1), PG05_Schematic Sheet3 (R46.1)
DPOT UP/~DOWN: PG04_Schematic Sheet2 (J2.9 U5.2), PG06_Schematic Sheet4 (R116.1)
DPOT ~CS: PG04_Schematic Sheet2 (J2.1 R48.2), PG06_Schematic Sheet4 (R113.1)
DPOT ~INC: PG04_Schematic Sheet2 (J2.10 R31.2 U5.1), PG06_Schematic Sheet4 (R117.1)
RSSI: PG03_Schematic Sheet1 (R50.2 U8.4), PG04_Schematic Sheet2 (FB3.1)